# EAGLE board SparkFun_FreeSoC2 (EAGLE 7.3.0)
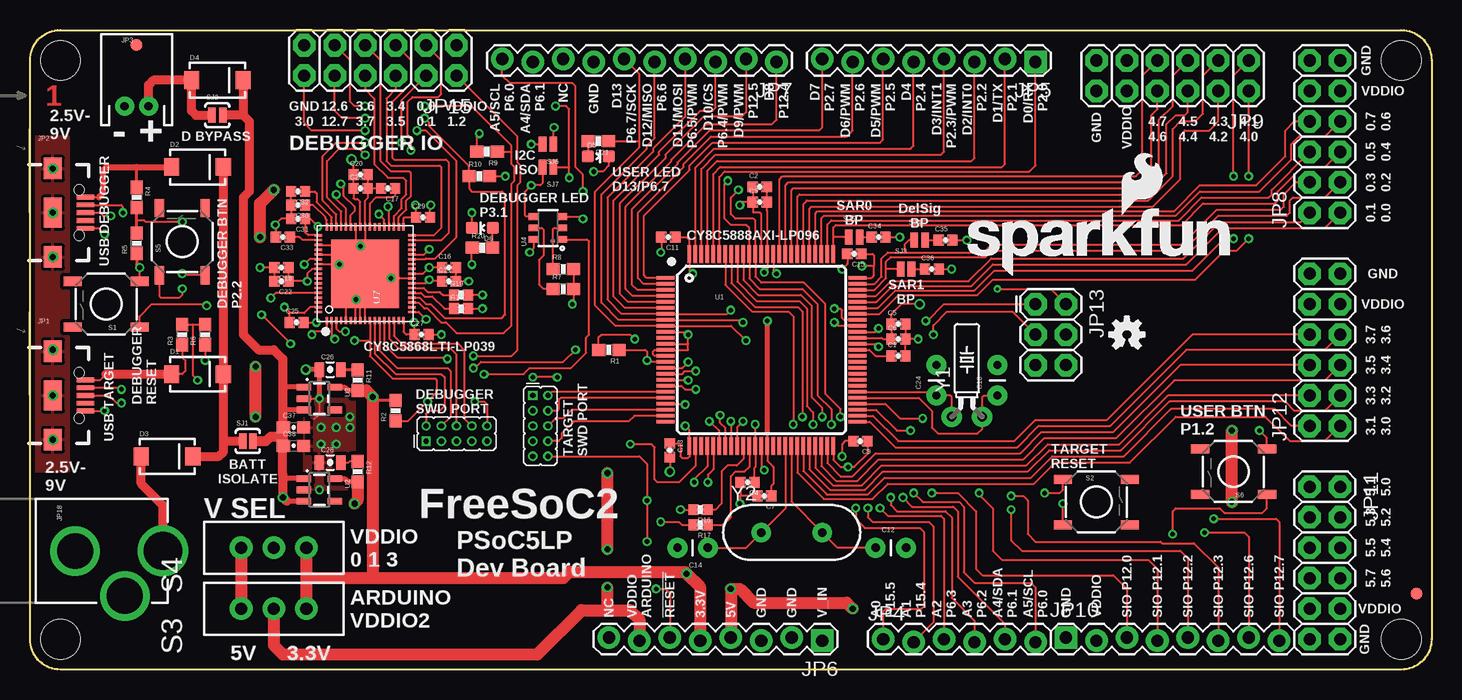
[diagram p3: board, top side]
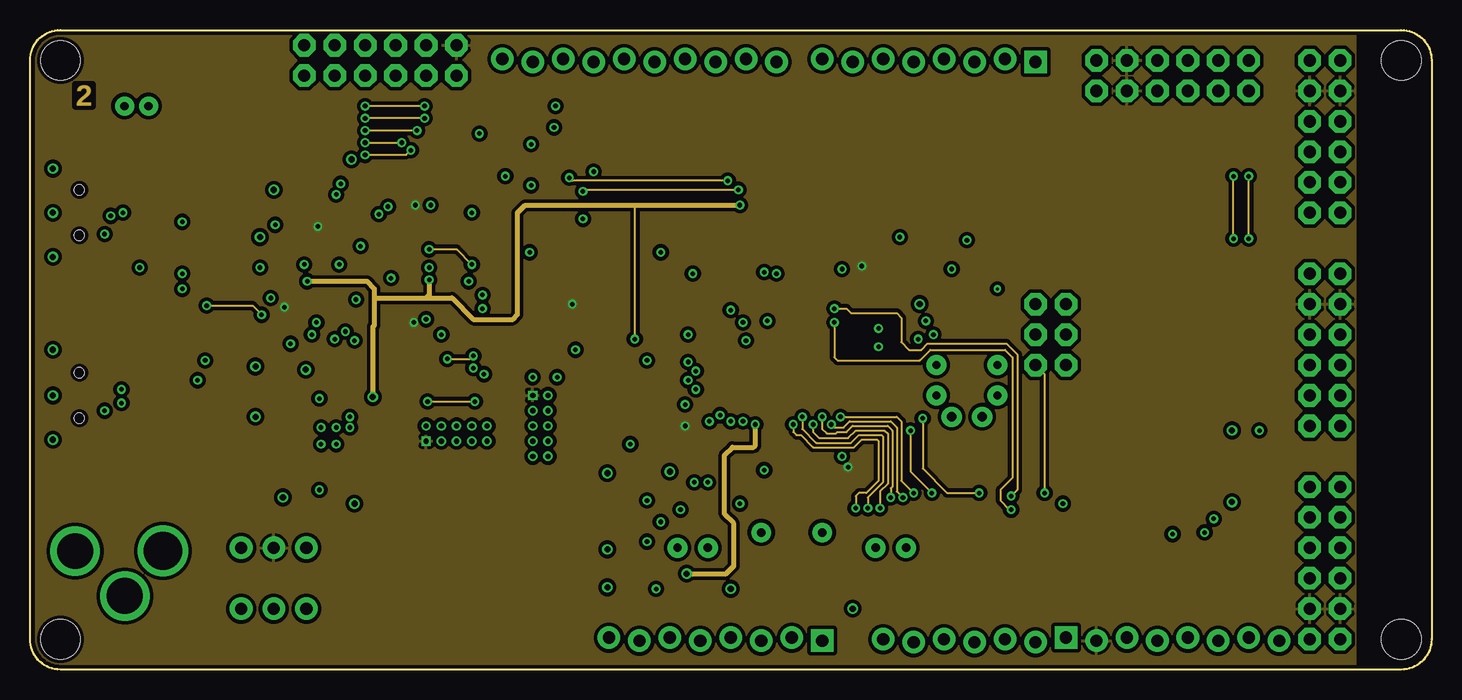
[diagram p4: board, inner layer Route2]
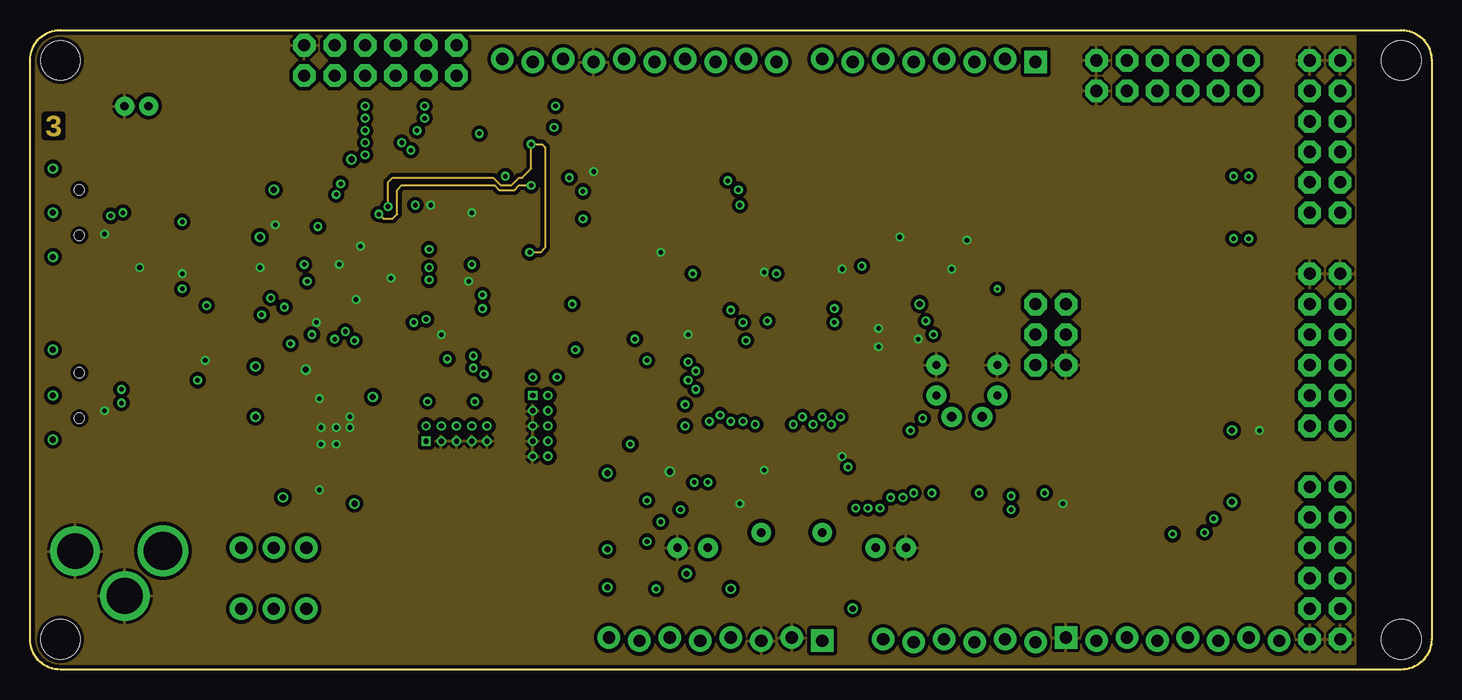
[diagram p5: board, inner layer Route15]
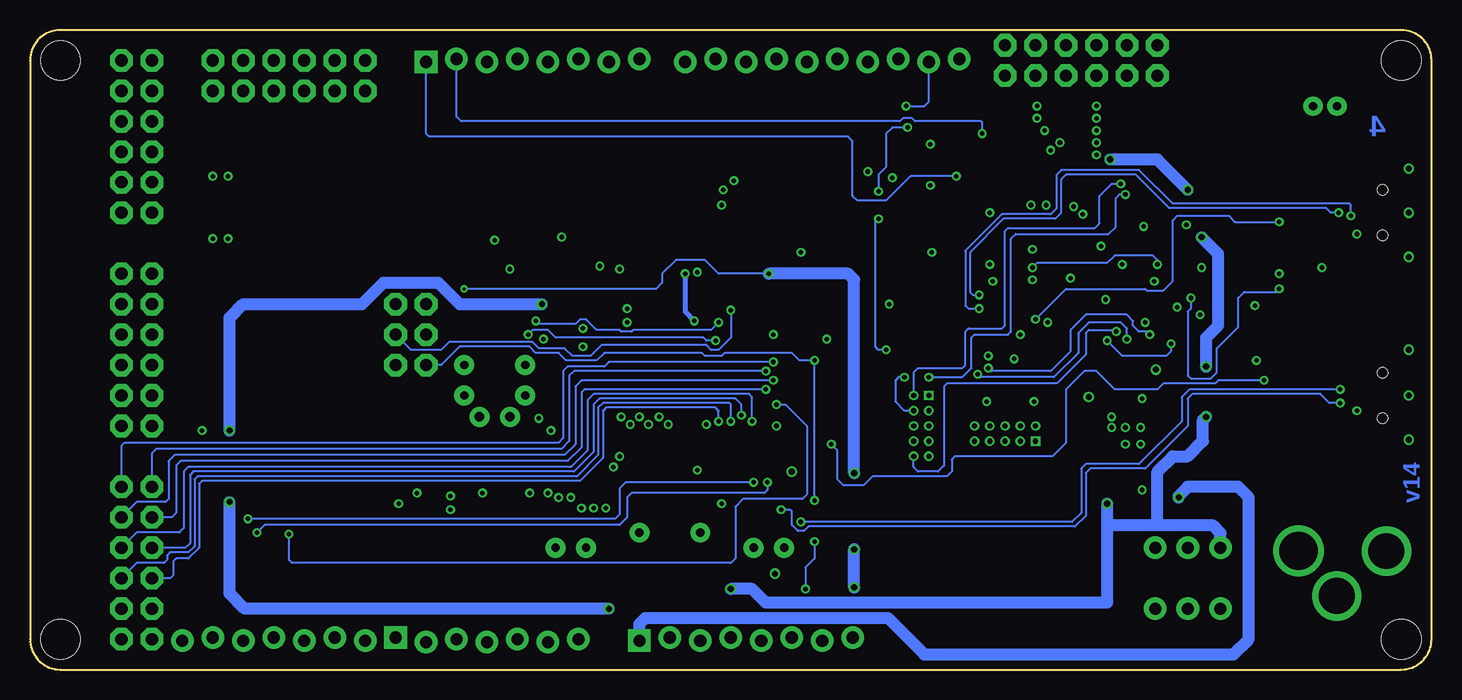
[diagram p6: board, bottom side, seen from below]

Size 116.84 x 53.34 mm. Coordinates in mm from the lower left corner, seen from the top.
Outline: 114.3,0 2.54,0 arc-90 0,2.54 0,50.8 arc-90 2.54,53.34 114.3,53.34 arc-90 116.84,50.8 116.84,2.54 arc-90 114.3,0
Copper layers (1*2*15*16): Top 0.035mm / dielectric 1.5mm / Route2 0.035mm / dielectric 0.15mm / Route15 0.035mm / dielectric 0.2mm / Bottom 0.035mm
Design rules "SparkFun-2-layer-TIGHT *": minimum track width 7mil, minimum drill 15mil, track to track 7mil, track to pad 7mil, pad to pad 7mil, via to via 7mil, smd to smd 7mil, copper to edge 7mil, drill to drill 7mil, minimum pad ring 7mil, minimum via ring 7mil, stop-mask expansion 4mil, vias tented up to drill 20mil, thermal gap 10mil
Net classes: 0 signal: width 0.178 mm, drill 0.381 mm, clearance 0.178 mm; 1 AVCC: width 0.508 mm, drill 0.508 mm, clearance 0.178 mm; 2 ARDUINO_VCC: width 0.508 mm, drill 0.381 mm

## Footprints (pad centres in the part's own frame; a part is rotated, then mirrored left to right if it is on the bottom)
0402-CAP = smd 0.85 x 0.9: 1 -0.58,0; 2 0.58,0
CAP-PTH-SMALL = drill 0.7 pad 1.651: 1 0,0; 2 2.54,0
0805-CAP = smd 0.8 x 1.2: 1 -0.9,0; 2 0.9,0
0603-CAP = smd 1.1 x 1: 1 -0.85,0; 2 0.85,0
SMA-DIODE = smd 1.27 x 1.47: A -2.15,0; C 2.15,0
LED-0603 = smd 1 x 1: A 0,-0.877; C 0,0.877
FIDUCIAL-1X2 = smd 1 x 1: 1 0,0
USB-B-MICRO-SMD_V03 = smd 1.45 x 0.4: D+1 2.725,0; D-1 2.725,0.65; GND1 2.725,-1.3; ID1 2.725,-0.65; VBUS1 2.725,1.3 | smd 1.5 x 1.8: SHIELD1 0,3.685; SHIELD2 0,-3.685 | smd 1.5 x 2.5: SHIELD3 0,0 | hole 0.85: 2.2,1.9; 2.2,-1.9
JST-2-PTH = drill 0.7 pad 1.6: 1 -1,0; 2 1,0
1X06-SIP_LOCK = drill 1.016 pad 1.88: 1 0,0; 2 2.54,-0.254; 3 5.08,0; 4 7.62,-0.254; 5 10.16,0; 6 12.7,-0.254
1X08_LOCK = drill 1.016 pad 1.88 square: 1 0,0.127 | drill 1.016 pad 1.88: 2 2.54,-0.127; 3 5.08,0.127; 4 7.62,-0.127; 5 10.16,0.127; 6 12.7,-0.127; 7 15.24,0.127; 8 17.78,-0.127
1X10_LOCK = drill 1.016 pad 1.88: 1 0,0.127; 2 2.54,-0.127; 3 5.08,0.127; 4 7.62,-0.127; 5 10.16,0.127; 6 12.7,-0.127; 7 15.24,0.127; 8 17.78,-0.127; 9 20.32,0.127; 10 22.86,-0.127
2X6 = drill 1.016 pad 1.88 octagon: 1 0,0; 2 0,2.54; 3 2.54,0; 4 2.54,2.54; 5 5.08,0; 6 5.08,2.54; 7 7.62,0; 8 7.62,2.54; 9 10.16,0; 10 10.16,2.54; 11 12.7,0; 12 12.7,2.54
2X3 = drill 1.016 pad 1.88 octagon: 1 0,0; 2 0,2.54; 3 2.54,0; 4 2.54,2.54; 5 5.08,0; 6 5.08,2.54
2X5_PTH_SILK_.05 = drill 0.432 square: 1 0,6.35 | drill 0.432: 2 1.27,6.35; 3 0,5.08; 4 1.27,5.08; 5 0,3.81; 6 1.27,3.81; 7 0,2.54; 8 1.27,2.54; 9 0,1.27; 10 1.27,1.27
POWER_JACK_PTH_LOCK = drill 2.997 pad 4.115: GND 0.025,6.557; GNDBREAK 3.762,10.7 | drill 3.2 pad 4.115: PWR 0,13.878
0603-RES = smd 1.1 x 1: 1 -0.85,0; 2 0.85,0
0603-RES@1 = smd 1.1 x 1: 1 -0.85,0; 2 0.85,0
0402-RES = smd 0.85 x 0.9: 1 -0.58,0; 2 0.58,0
TACTILE-SWITCH-SMD = smd 1.524 x 0.762: 1 -2.794,1.905; 2 2.794,1.905; 3 -2.794,-1.905; 4 2.794,-1.905
SWITCH-SPDT_LOCK.007S = drill 1.016 pad 1.88: 1 0,2.718; 2 0,0; 3 0,-2.718
PAD-JUMPER-2-NC_BY_PASTE_YES_SILK = smd 0.635 x 1.27: 1 -0.401,0; 2 0.413,0
PAD-JUMPER-2-NO_YES_SILK = smd 0.635 x 1.27: 1 -0.45,0; 2 0.45,0
PAD-JUMPER-2-NO_NO_SILK = smd 0.635 x 1.27: 1 -0.45,0; 2 0.45,0
STAND-OFF = hole 3.302: 0,0
TQFP-100-14X14MM = smd 1.5 x 0.27: 1 -8,6; 2 -8,5.5; 3 -8,5; 4 -8,4.5; 5 -8,4; 6 -8,3.5; 7 -8,3; 8 -8,2.5; 9 -8,2; 10 -8,1.5; 11 -8,1; 12 -8,0.5; 13 -8,0; 14 -8,-0.5; 15 -8,-1; 16 -8,-1.5; 17 -8,-2; 18 -8,-2.5; 19 -8,-3; 20 -8,-3.5; 21 -8,-4; 22 -8,-4.5; 23 -8,-5; 24 -8,-5.5; 25 -8,-6; 51 8,-6; 52 8,-5.5; 53 8,-5; 54 8,-4.5; 55 8,-4; 56 8,-3.5; 57 8,-3; 58 8,-2.5; 59 8,-2; 60 8,-1.5; 61 8,-1; 62 8,-0.5; 63 8,0; 64 8,0.5; 65 8,1; 66 8,1.5; 67 8,2; 68 8,2.5; 69 8,3; 70 8,3.5; 71 8,4; 72 8,4.5; 73 8,5; 74 8,5.5; 75 8,6 | smd 0.27 x 1.5: 26 -6,-8; 27 -5.5,-8; 28 -5,-8; 29 -4.5,-8; 30 -4,-8; 31 -3.5,-8; 32 -3,-8; 33 -2.5,-8; 34 -2,-8; 35 -1.5,-8; 36 -1,-8; 37 -0.5,-8; 38 0,-8; 39 0.5,-8; 40 1,-8; 41 1.5,-8; 42 2,-8; 43 2.5,-8; 44 3,-8; 45 3.5,-8; 46 4,-8; 47 4.5,-8; 48 5,-8; 49 5.5,-8; 50 6,-8; 76 6,8; 77 5.5,8; 78 5,8; 79 4.5,8; 80 4,8; 81 3.5,8; 82 3,8; 83 2.5,8; 84 2,8; 85 1.5,8; 86 1,8; 87 0.5,8; 88 0,8; 89 -0.5,8; 90 -1,8; 91 -1.5,8; 92 -2,8; 93 -2.5,8; 94 -3,8; 95 -3.5,8; 96 -4,8; 97 -4.5,8; 98 -5,8; 99 -5.5,8; 100 -6,8
SOT23-5 = smd 0.55 x 1.2: 1 -0.95,-1.3; 2 0,-1.3; 3 0.95,-1.3; 4 0.95,1.3; 5 -0.95,1.3
SOT26 = smd 0.55 x 0.8: D1 -0.95,1.2; D2 0.95,1.2; G1 -0.95,-1.2; G2 0.95,-1.2; S1 0,1.2; S2 0,-1.2
QFN-68 = smd 0.6 x 0.2: 1 -3.9,3.2; 2 -3.9,2.8; 3 -3.9,2.4; 4 -3.9,2; 5 -3.9,1.6; 6 -3.9,1.2; 7 -3.9,0.8; 8 -3.9,0.4; 9 -3.9,0; 10 -3.9,-0.4; 11 -3.9,-0.8; 12 -3.9,-1.2; 13 -3.9,-1.6; 14 -3.9,-2; 15 -3.9,-2.4; 16 -3.9,-2.8; 17 -3.9,-3.2; 35 3.9,-3.2; 36 3.9,-2.8; 37 3.9,-2.4; 38 3.9,-2; 39 3.9,-1.6; 40 3.9,-1.2; 41 3.9,-0.8; 42 3.9,-0.4; 43 3.9,0; 44 3.9,0.4; 45 3.9,0.8; 46 3.9,1.2; 47 3.9,1.6; 48 3.9,2; 49 3.9,2.4; 50 3.9,2.8; 51 3.9,3.2 | smd 0.2 x 0.6: 18 -3.2,-3.9; 19 -2.8,-3.9; 20 -2.4,-3.9; 21 -2,-3.9; 22 -1.6,-3.9; 23 -1.2,-3.9; 24 -0.8,-3.9; 25 -0.4,-3.9; 26 0,-3.9; 27 0.4,-3.9; 28 0.8,-3.9; 29 1.2,-3.9; 30 1.6,-3.9; 31 2,-3.9; 32 2.4,-3.9; 33 2.8,-3.9; 34 3.2,-3.9; 52 3.2,3.9; 53 2.8,3.9; 54 2.4,3.9; 55 2,3.9; 56 1.6,3.9; 57 1.2,3.9; 58 0.8,3.9; 59 0.4,3.9; 60 0,3.9; 61 -0.4,3.9; 62 -0.8,3.9; 63 -1.2,3.9; 64 -1.6,3.9; 65 -2,3.9; 66 -2.4,3.9; 67 -2.8,3.9; 68 -3.2,3.9 | smd 5.7 x 5.7: 69 0,0
TC26H = drill 0.813 pad 1.676: 1 -1.27,0; 2 1.27,0
HC49US = drill 0.7 pad 1.651: 1 -2.54,0; 2 2.54,0

## Placement (x,y rotation side)
C1  1.0uF  [0402-CAP]  72.39,26.16 0 top
C2  1.0uF  [0402-CAP]  60.83,40.26 0 top
C3  0.1uF  [0402-CAP]  60.83,38.99 0 top
C4  1.0uF  [0402-CAP]  59.82,15.62 180 top
C5  1.0uF  [0402-CAP]  72.39,28.83 0 top
C6  0.1uF  [0402-CAP]  72.39,27.56 0 top
C7  1.0uF  [0402-CAP]  61.21,14.48 180 top
C9  0.1uF  [0402-CAP]  69.22,19.05 180 top
C11  0.1uF  [0402-CAP]  53.21,36.07 180 top
C12  [CAP-PTH-SMALL]  70.48,10.16 0 top
C13  0.1uF  [0402-CAP]  53.34,18.29 270 top
C14  [CAP-PTH-SMALL]  56.52,10.16 180 top
C15  0.1uF  [0402-CAP]  68.71,34.67 180 top
C16  1.0uF  [0402-CAP]  34.92,33.53 0 top
C17  1.0uF  [0402-CAP]  29.84,40.13 180 top
C18  [CAP-PTH-SMALL]  80.64,22.86 90 top
C19  1.0uF  [0402-CAP]  20.95,33.53 180 top
C20  1.0uF  [0402-CAP]  27.56,41.27 0 top
C21  0.1uF  [0402-CAP]  34.92,32.38 0 top
C22  0.1uF  [0402-CAP]  20.95,32.38 180 top
C23  0.1uF  [0402-CAP]  27.56,40.13 0 top
C24  [CAP-PTH-SMALL]  75.56,22.86 90 top
C25  0.1uF  [0402-CAP]  22.23,28.96 0 top
C26  10uF  [0805-CAP]  25.02,25.02 0 top
C27  0.1uF  [0402-CAP]  32.64,27.94 0 top
C28  10uF  [0805-CAP]  25.02,17.27 0 top
C29  0.1uF  [0402-CAP]  32.77,37.72 0 top
C30  0.1uF  [0402-CAP]  22.35,38.73 180 top
C31  0.1uF  [0402-CAP]  22.35,37.59 180 top
C32  0.1uF  [0402-CAP]  22.35,39.88 180 top
C33  0.1uF  [0402-CAP]  21.08,36.07 180 top
C34  0.1uF  [0402-CAP]  70.74,36.07 0 top
C35  0.1uF  [0402-CAP]  76.33,35.81 0 top
C36  0.1uF  [0402-CAP]  75.18,33.4 0 top
C37  1.0uF  [0603-CAP]  21.97,20.19 0 top
C38  0.1uF  [0603-CAP]  21.97,18.67 0 top
D1  MBRA140  [SMA-DIODE]  13.97,24.64 0 top
D2  MBRA140  [SMA-DIODE]  13.97,41.91 0 top
D3  MBRA140  [SMA-DIODE]  11.43,17.78 0 top
D4  MBRA140  [SMA-DIODE]  15.62,49.15 0 top
D5  RED  [LED-0603]  47.37,42.8 270 top
D6  RED  [LED-0603]  37.72,36.83 90 top
FID1  FIDUCIAL1X2  [FIDUCIAL-1X2]  115.57,6.35 0 top
FID2  FIDUCIAL1X2  [FIDUCIAL-1X2]  8.89,52.07 0 top
FRAME1  FRAME-LETTERNO_PACKAGE  [DUMMY]  -15.24,-15.24 0 top  (outside the outline)
FRAME2  FRAME-LETTERNO_PACKAGE  [DUMMY]  -15.24,-16.51 0 top  (outside the outline)
FRAME3  FRAME-LETTERNO_PACKAGE  [DUMMY]  -15.24,-17.78 0 top  (outside the outline)
JP1  MicroB  [USB-B-MICRO-SMD_V03]  1.91,22.86 0 top
JP2  MicroB  [USB-B-MICRO-SMD_V03]  1.91,38.1 0 top
JP3  [JST-2-PTH]  8.89,46.99 0 top
JP4  1X6 FEMALE PTH  [1X06-SIP_LOCK]  71.12,2.54 0 top
JP5  1X8 FEMALE PTH  [1X08_LOCK]  83.82,50.8 180 top
JP6  1X8 FEMALE PTH  [1X08_LOCK]  66.04,2.54 180 top
JP7  1X10 FEMALE PTH  [1X10_LOCK]  62.23,50.8 180 top
JP8  2X6 FEMALE  [2X6]  109.22,38.1 90 top
JP9  2X6 FEMALE  [2X6]  101.6,50.8 180 top
JP10  1x8 FEMALE PTH  [1X08_LOCK]  86.36,2.54 0 top
JP11  2X6 FEMALE  [2X6]  106.68,15.24 270 top
JP12  2X6 FEMALE  [2X6]  109.22,20.32 90 top
JP13  [2X3]  83.82,30.48 270 top
JP14  DNP  [2X5_PTH_SILK_.05]  39.37,19.05 90 top
JP15  2X6 FEMALE  [2X6]  35.56,52.07 180 top
JP17  DNP  [2X5_PTH_SILK_.05]  41.91,16.51 0 top
JP18  POWER_JACKPTH_LOCK  [POWER_JACK_PTH_LOCK]  -2.79,9.91 270 top
LOGO1  SFE_LOGO_NAME_FLAME.2_INCH  [SFE_LOGO_NAME_FLAME_.2]  77.47,32.77 0 top
LOGO2  OSHW-LOGOS  [OSHW-LOGO-S]  91.44,27.94 0 top
R1  4.7K  [0603-RES]  48.26,26.67 180 top
R2  4.7K  [0603-RES]  30.48,21.59 90 top
R3  10K  [0603-RES]  12.7,27.94 90 top
R4  10K  [0603-RES]  8.89,39.37 270 top
R5  20k  [0603-RES]  8.89,35.56 90 top
R6  20k  [0603-RES]  14.61,27.94 90 top
R7  2.2k  [0603-RES]  44.45,31.75 0 top
R8  2.2k  [0603-RES]  44.45,33.4 0 top
R9  1K  [0603-RES@1]  38.1,43.18 180 top
R10  1K  [0603-RES@1]  37.47,41.15 0 top
R11  0.27  [0603-RES]  27.3,24.13 270 top
R12  0.27  [0603-RES]  27.3,16.51 270 top
R16  22  [0402-RES]  55.88,13.34 180 top
R17  22  [0402-RES]  55.88,12.06 180 top
R18  22  [0402-RES]  35.94,30.1 0 top
R19  22  [0402-RES]  35.94,31.24 0 top
R20  1K  [0603-RES@1]  37.72,35.18 0 top
R21  1K  [0603-RES@1]  47.37,44.07 180 top
S1  SPST-MOM  [TACTILE-SWITCH-SMD]  6.35,30.48 180 top
S2  SPST-MOM  [TACTILE-SWITCH-SMD]  88.9,13.97 0 top
S3  SPDT  [SWITCH-SPDT_LOCK.007S]  20.32,5.08 90 top
S4  SPDT  [SWITCH-SPDT_LOCK.007S]  20.32,10.16 90 top
S5  SPST-MOM  [TACTILE-SWITCH-SMD]  12.7,35.69 90 top
S6  SPST-MOM  [TACTILE-SWITCH-SMD]  100.33,16.51 180 top
SJ1  JUMPER-PAD-2-NC_BY_PASTE  [PAD-JUMPER-2-NC_BY_PASTE_YES_SILK]  18.16,19.05 0 top
SJ2  JUMPER-PAD-2-NOYES_SILK  [PAD-JUMPER-2-NO_YES_SILK]  15.62,46.23 0 top
SJ3  JUMPER-PAD-2-NO  [PAD-JUMPER-2-NO_NO_SILK]  73.03,33.4 0 top
SJ4  JUMPER-PAD-2-NO  [PAD-JUMPER-2-NO_NO_SILK]  74.17,35.81 0 top
SJ5  JUMPER-PAD-2-NO  [PAD-JUMPER-2-NO_NO_SILK]  68.71,36.07 0 top
SJ6  JUMPER-PAD-2-NO  [PAD-JUMPER-2-NO_NO_SILK]  43.18,43.81 180 top
SJ7  JUMPER-PAD-2-NO  [PAD-JUMPER-2-NO_NO_SILK]  43.18,41.91 180 top
STANDOFF1  STAND-OFF  [STAND-OFF]  2.54,2.54 0 top
STANDOFF2  STAND-OFF  [STAND-OFF]  2.54,50.8 0 top
STANDOFF3  STAND-OFF  [STAND-OFF]  114.3,50.8 0 top
STANDOFF4  STAND-OFF  [STAND-OFF]  114.3,2.54 0 top
U1  CY8C5888AXI-LP096  [TQFP-100-14X14MM]  60.96,26.67 0 top
U2  MIC5219 5V  [SOT23-5]  24.13,14.99 270 top
U3  MIC5219 3.3V  [SOT23-5]  24.13,22.61 270 top
U4  2A/20V  [SOT26]  43.18,36.83 90 top
U7  CY8C5868LTI-LP039  [QFN-68]  27.94,33.02 90 top
U$1  FOUR_LAYER_WARNING  [FOUR_LAYER_WARNING]  15.24,-2.16 0 top
U$2  [CREATIVE_COMMONS@1]  35.56,-27.94 0 top  (outside the outline)
Y1  32.768kHz  [TC26H]  78.11,21.08 0 top
Y2  [HC49US]  63.5,11.43 0 top

## Tracks (layer width: path | path; a pad name or v marks a point on that pad's centre or on a via)
3.3V  (via drill 0.38, 0.51)
  Top 0.178: 29,20.92 28.57,21.34 | C19.1 C22.1 v23.11,32.38 23.11,33.02 23.51,33.42 U7.59 | U7.24 32.98,32.22 v33.27,32.51 33.4,32.38 C21.1 | C4.1 60.4,16.84 60.47,16.91 U1.37 v60.46,20.44 v60.45,20.45 | U1.88 60.96,37.97 60.83,38.1 60.33,38.1 60.25,38.17 C3.1 | C2.1 C3.1 | C3.1 59.44,38.99 v59.18,38.73 | R1.2 47.41,27.73 47.62,27.94 50.04,27.94 v50.42,27.56
  Top 0.254: R2.2 28.87,22.44 v28.57,22.73
  Top 0.406: U3.5 26.23,23.56 26.5,23.28 R11.2
  Top 1.016: JP6.5 55.88,6.86 v54.74,8 54.61,8.13 44.96,8.13 44.45,7.62 28.45,7.62 | 28.45,7.62 23.04,7.62 | 28.45,7.62 28.57,7.75 28.57,21.34 v28.57,22.73 28.03,23.28 R11.2 | S4.3 23.04,7.62 | 23.04,7.62 S3.3
  Route2 0.178: v50.42,27.56 50.42,38.73
  Route2 0.406: v23.11,32.38 28.07,32.38 28.7,31.75 28.7,30.99 | 28.7,30.99 28.7,28.7 28.57,28.57 v28.57,22.73 | v54.74,8 58.04,8 58.67,8.64 58.67,12.19 57.91,12.95 57.91,17.91 58.55,18.54 60.33,18.54 U1.37 v60.46,20.44 v60.45,20.45 | 57.78,38.73 v59.18,38.73 50.42,38.73 41.27,38.73 40.64,38.1 40.64,29.59 40.26,29.21 36.96,29.21 35.18,30.99 33.02,30.99 | 28.7,30.99 33.02,30.99 | v33.27,32.51 33.27,31.24 33.02,30.99
5V  (via drill 0.51)
  Top 0.178: 25.36,16 U2.5 | U1.65 71.01,27.67 71.12,27.56 C6.1 C5.1 71.81,29.16 71.75,29.21 | 71.75,29.21 71.75,29.59 72.64,30.48 v74.17,30.48 | 71.75,29.21 71.75,28.84 | U7.44 27.54,39.01 27.3,39.24 27.05,39.24 26.98,39.31 C23.1 C20.1 26.98,42.36 v26.8,42.55 26.91,42.43
  Top 0.406: U2.5 26.23,15.94 26.5,15.66 R12.2
  Top 1.016: S4.1 S3.1 | JP6.4 v58.42,6.73 59.18,6.73 60.33,5.59 68.07,5.59 v68.58,5.08 | v100.2,13.97 v100.2,19.94 | v18.8,21.08 v18.8,25.27 | v19.18,36.07 19.18,38.86 v20.32,40.01 | R12.2 27.3,14.1 v27.05,13.84
  Bottom 1.016: 27.05,12.06 22.86,12.06 | 22.86,12.06 18.29,12.06 17.6,11.38 S4.1 | v27.05,13.84 27.05,12.06 | 27.05,12.06 27.05,5.59 55.5,5.59 56.64,6.73 v58.42,6.73 | v68.58,5.08 98.93,5.08 100.2,6.35 v100.2,13.97 | v100.2,19.94 100.2,29.34 99.06,30.48 89.15,30.48 87.38,32.26 82.8,32.26 81.03,30.48 v74.17,30.48 | 22.86,12.06 22.86,16.51 21.59,17.78 20.32,17.78 19.05,19.05 19.05,20.83 v18.8,21.08 | v18.8,25.27 18.8,27.69 17.78,28.7 17.78,34.67 v19.18,36.07 | v20.32,40.01 22.86,42.55 v26.8,42.55
!DEBUG_P2.6_SCL_PU_EN  (via drill 0.38)
  Top 0.178: U7.1 24.74,28.55 24.38,28.19 23.75,28.19 v23.5,27.94 | v36.96,25.15 37.08,25.15 37.59,25.65 44.45,25.65 v45.47,26.67 | U4.G2 45.91,37.78 v46.1,37.59
  Bottom 0.178: v23.5,27.94 23.75,28.19 24.38,28.19 24.89,28.7 24.89,29.08 25.4,29.59 28.83,29.59 30.1,28.32 30.1,26.54 31.75,24.89 36.7,24.89 v36.96,25.15 | v45.47,26.67 46.1,26.67 46.35,26.92 46.35,37.34 v46.1,37.59
!DEBUG_P2.7_SDA_PU_EN  (via drill 0.38)
  Top 0.178: U7.2 25.14,27.82 v25.4,27.56 | v37.85,24.64 41.15,24.64 41.66,25.15 45.09,25.15 46.35,26.42 46.35,27.69 46.61,27.94 46.61,35.69 46.42,35.88 U4.G1
  Bottom 0.178: v25.4,27.56 25.4,28.45 25.91,28.96 28.57,28.96 29.46,28.07 29.46,26.42 31.5,24.38 37.59,24.38 v37.85,24.64
!DEBUG_RESET  (via drill 0.38)
  Top 0.178: U7.10 28.34,27.43 | 28.34,27.43 28.34,26.14 30.23,24.26 33.78,24.26 33.91,24.13 33.91,23.11 v33.15,22.35 31.54,20.74 R2.1 | v37.08,22.35 37.85,22.35 38.1,22.1 JP14.10 | S1.1 9.14,29.46 10.16,30.48 14.61,30.48 v14.73,30.35 | v19.3,29.59 v21.72,27.18 | v27.05,27.43 28.34,27.43
  Route2 0.178: v33.15,22.35 v37.08,22.35 | v14.73,30.35 18.54,30.35 v19.3,29.59
  Bottom 0.178: v21.72,27.18 21.72,26.54 22.1,26.16 25.78,26.16 v27.05,27.43
!RESET  (via drill 0.38)
  Top 0.178: U1.15 51.55,25.67 v51.44,25.78 51.44,26.54 51.31,26.67 R1.1 | v84.58,14.73 85.85,14.73 86.11,14.99 S2.1 | v51.44,10.67 v51.44,14.1 51.44,17.14 50.8,17.78 JP17.10 | v52.2,6.73 52.96,6.73 53.34,6.35 JP6.6 | U7.3 25.54,28.43 25.78,28.19 v26.29,28.19
  Route2 0.178: JP13.5 84.58,24.64 v84.58,14.73
  Bottom 0.178: v51.44,14.1 v51.44,25.78 52.7,25.78 53.34,26.42 58.93,26.42 59.18,26.16 60.58,26.16 60.83,26.42 68.96,26.42 69.6,25.78 72.14,25.78 72.77,26.42 74.68,26.42 75.18,26.92 81.03,26.92 82.55,25.4 JP13.5 | JP17.10 43.18,16.89 42.8,16.51 41.15,16.51 40.64,17.02 40.64,23.62 40.39,23.88 31.24,23.88 28.83,26.29 28.83,28.07 28.57,28.32 26.42,28.32 v26.29,28.19 | v51.44,10.67 51.44,9.27 52.2,8.51 v52.2,6.73
A0  (via drill 0.38)
  Top 0.178: U1.94 57.96,32.08 60.2,29.84 63.25,29.84 63.63,29.46 v63.63,20.45 | v68.83,13.46 68.83,12.57 69.6,11.81 74.17,11.81 74.55,11.43 74.55,5.33 74.3,5.08 71.37,5.08 71.12,4.83 JP4.1
  Route2 0.178: v63.63,20.45 63.63,19.81 63.88,19.56 64.26,19.56 65.28,18.54 68.71,18.54 69.34,19.18 70.61,19.18 70.74,19.05 70.74,15.75 69.72,14.73 69.09,14.73 68.83,14.48 v68.83,13.46
A1  (via drill 0.38)
  Top 0.178: U1.93 58.46,32.22 60.45,30.23 64.01,30.23 64.39,29.84 v64.39,21.08 | v69.85,13.46 69.85,12.7 70.23,12.32 74.93,12.32 75.31,11.94 75.31,3.94 JP4.2
  Route2 0.178: v64.39,21.08 64.39,20.07 65.53,18.92 68.45,18.92 69.09,19.56 70.99,19.56 71.12,19.43 71.12,15.62 69.85,14.35 v69.85,13.46
A2  (via drill 0.38)
  Top 0.178: U1.92 58.96,32.35 60.58,30.73 64.14,30.73 64.77,30.1 64.77,21.97 65.28,21.46 v65.28,20.45 | v70.87,13.46 71.5,12.83 75.95,12.83 76.2,12.57 JP4.3
  Route2 0.178: v65.28,20.45 65.28,19.81 65.79,19.3 68.2,19.3 68.83,19.94 71.25,19.94 71.5,19.68 71.5,15.49 70.87,14.86 v70.87,13.46
A3  (via drill 0.38)
  Top 0.178: U1.91 59.46,32.49 60.71,31.24 64.26,31.24 65.15,30.35 65.15,22.73 66.04,21.84 v66.04,21.08 | v71.75,14.35 71.75,13.72 72.26,13.21 76.33,13.21 76.83,12.7 76.83,5.97 78.74,4.06 JP4.4
  Route2 0.178: v66.04,21.08 66.04,20.07 66.42,19.68 67.18,19.68 67.31,19.81 68.07,19.81 68.58,20.32 71.5,20.32 71.88,19.94 71.88,15.24 71.75,15.11 v71.75,14.35
A4  (via drill 0.38)
  Top 0.178: v66.8,20.45 66.8,21.72 65.66,22.86 65.66,30.48 64.39,31.75 60.83,31.75 59.96,32.62 U1.90 59.96,36.81 59.69,37.08 58.42,37.08 57.91,37.59 57.91,40.51 v58.17,40.77 | v72.77,14.35 73.53,13.59 76.96,13.59 77.34,13.21 77.34,7.75 81.28,3.81 JP4.5 | v44.96,41.02 44.96,41.91 | 44.96,41.91 44.96,46.74 44.7,46.99 v43.81,46.99 | SJ7.1 44.96,41.91
  Route2 0.178: v66.8,20.45 67.06,20.19 67.82,20.19 68.33,20.7 71.75,20.7 72.26,20.19 72.26,14.86 v72.77,14.35 | v58.17,40.77 45.21,40.77 v44.96,41.02
  Bottom 0.178: v43.81,46.99 42.29,46.99 41.91,47.37 JP7.9
A5  (via drill 0.38)
  Top 0.178: v59.05,40.01 58.42,39.37 58.42,37.97 58.8,37.59 60.33,37.59 60.46,37.46 U1.89 60.46,32.76 60.96,32.26 64.52,32.26 66.29,30.48 66.29,22.99 67.56,21.72 v67.56,21.08 | v46.1,39.88 46.1,41.27 45.47,41.91 45.47,48.64 45.21,48.9 40.01,48.9 39.37,49.53 JP7.10 | v73.66,14.73 74.42,13.97 77.47,13.97 77.85,13.59 77.85,8.13 78.74,7.24 83.44,7.24 83.82,6.86 JP4.6 | SJ6.1 43.63,45.15 v43.69,45.21
  Route2 0.178: v67.56,21.08 72.26,21.08 72.64,20.7 72.64,15.75 v73.66,14.73 | v59.05,40.01 46.23,40.01 v46.1,39.88
  Bottom 0.178: v43.69,45.21 44.96,45.21 45.47,44.7 45.47,41.91 46.1,41.27 v46.1,39.88
ANCHOR_POUR  (via drill 0.51)
  other vias: 1.91,38.1 1.91,22.86 1.91,19.18
  pour Top (isolate 0.305): 0,44.45 3.17,44.45 3.17,16.51 0,16.51
D0  (via drill 0.38)
  Top 0.178: U1.95 57.46,41.08 57.91,41.53 83.31,41.53 83.82,42.04 JP5.1 | R10.2 v39.62,41.15
  Bottom 0.178: JP5.1 83.82,44.7 83.57,44.45 48.64,44.45 48.26,44.07 48.26,39.5 47.88,39.12 45.47,39.12 43.43,41.15 v39.62,41.15
D1  (via drill 0.38)
  Top 0.178: U1.96 56.96,41.34 57.53,41.91 81.03,41.91 81.28,42.16 JP5.2 | R9.2 37.25,44.49 v37.47,44.7
  Bottom 0.178: v37.47,44.7 37.47,45.59 37.59,45.72 43.05,45.72 43.31,45.97 44.07,45.97 44.32,45.72 80.9,45.72 81.28,46.1 JP5.2
D2
  Top 0.178: U1.97 56.46,41.6 57.28,42.42 78.49,42.42 78.74,42.67 JP5.3
D3
  Top 0.178: U1.98 55.96,41.74 57.15,42.93 75.95,42.93 76.2,43.18 JP5.4
D4
  Top 0.178: U1.99 55.46,41.87 57.02,43.43 73.41,43.43 73.66,43.69 JP5.5
D5
  Top 0.178: U1.1 51.4,32.67 51.18,32.89 51.18,37.85 54.99,41.66 54.99,42.04 56.9,43.94 70.87,43.94 71.12,44.2 JP5.6
D6
  Top 0.178: U1.2 51.14,32.17 50.67,32.64 50.67,38.1 54.48,41.91 54.48,42.16 56.77,44.45 68.07,44.45 68.58,44.96 JP5.7
D7
  Top 0.178: JP5.8 66.04,45.21 65.79,44.96 56.64,44.96 53.98,42.29 53.98,42.16 50.16,38.35 50.16,32.13 50.63,31.67 U1.3
D8
  Top 0.178: U1.4 50.24,31.17 49.66,31.75 49.66,38.61 53.47,42.42 53.47,42.55 56.39,45.47 61.85,45.47 62.23,45.85 JP7.1
D9
  Top 0.178: JP7.2 59.69,46.48 59.31,46.1 56.13,46.1 52.96,42.93 52.96,42.67 49.15,38.86 49.15,31.37 49.85,30.67 U1.5
D10
  Top 0.178: U1.6 49.59,30.17 48.64,31.11 48.64,39.12 52.45,42.93 52.45,43.18 55.88,46.61 56.9,46.61 57.15,46.86 JP7.3
D11  (via drill 0.38)
  Top 0.178: JP7.4 54.61,46.1 51.94,43.43 51.94,43.18 48.13,39.37 48.13,30.86 49.32,29.67 U1.7 58.12,29.67 v58.42,29.97
  Bottom 0.178: v58.42,29.97 58.42,27.69 59.44,26.67 60.07,26.67 60.45,27.05 69.22,27.05 70.1,26.16 71.63,26.16 72.26,26.8 74.42,26.8 74.93,27.3 81.92,27.3 82.55,26.67 85.09,26.67 JP13.4
D12  (via drill 0.38)
  Top 0.178: JP7.5 52.07,44.32 51.44,43.69 51.44,43.43 47.62,39.62 47.62,30.61 49.06,29.17 U1.8 59.22,29.17 v59.44,28.96 | v74.68,29.08 74.8,29.08 76.2,30.48 JP13.1
  Bottom 0.178: v59.44,28.96 60.07,28.32 66.55,28.32 66.67,28.19 67.56,28.19 67.69,28.32 69.6,28.32 70.48,29.21 70.99,29.21 71.37,28.83 74.42,28.83 v74.68,29.08
D13  (via drill 0.38)
  Top 0.178: 50.8,44.07 50.8,43.56 47.12,39.88 47.12,30.35 48.8,28.67 U1.9 58.45,28.67 v59.69,27.43 | 50.8,44.07 50.8,49.66 JP7.6 | R21.1 50.8,44.07 | v75.31,27.94 75.31,28.7 76.45,29.84 81.92,29.84 JP13.3
  Bottom 0.178: v59.69,27.43 60.45,27.43 60.71,27.69 73.03,27.69 73.66,28.32 74.93,28.32 v75.31,27.94
DEBUG_BTN  (via drill 0.38)
  Top 0.178: U7.64 20.5,31.42 v20.07,30.99 | v12.7,31.75 12.7,31.24 12.45,30.99 10.92,30.99 10.79,31.11 S5.1
  Bottom 0.178: v20.07,30.99 20.07,30.1 20.32,29.84 20.32,24.51 20.07,24.26 18.41,24.26 17.91,24.77 17.91,26.8 16.13,28.57 16.13,30.99 15.62,31.5 12.95,31.5 v12.7,31.75
DEBUG_D+_BUS  (via drill 0.38)
  Top 0.178: JP2.D+1 5.84,38.1 6.1,37.85 v6.73,37.85 | 37.47,30.1 v37.72,30.1 R18.2
  Bottom 0.178: v6.73,37.85 6.73,38.73 6.86,38.86 21.59,38.86 24.38,41.66 30.86,41.66 31.24,41.27 31.24,38.48 31.75,37.97 35.81,37.97 38.86,34.92 38.86,30.35 38.61,30.1 v37.72,30.1
DEBUG_D+_PAD
  Top 0.178: U7.22 32.59,31.42 32.89,31.11 33.53,31.11 34.54,30.1 R18.1
DEBUG_D-_BUS  (via drill 0.38)
  Top 0.178: JP2.D-1 7.61,38.75 7.75,38.61 v7.75,38.1 | v37.72,31.24 R19.2
  Bottom 0.178: v7.75,38.1 8.38,38.1 8.76,38.48 21.84,38.48 24.64,41.27 30.48,41.27 30.86,40.89 30.86,38.1 31.37,37.59 35.69,37.59 38.48,34.8 38.48,31.5 38.23,31.24 v37.72,31.24
DEBUG_D-_PAD
  Top 0.178: U7.23 32.82,31.82 33.15,31.5 34.16,31.5 34.42,31.24 R19.1
DEBUG_DS_BP
  Top 0.178: U7.51 24.74,37.49 24.64,37.59 24.64,37.72 23.62,38.73 C30.1
DEBUG_LED  (via drill 0.38)
  Top 0.178: U7.30 32.84,34.62 v33.27,35.05 | v36.83,33.78 36.83,35.14 R20.1
  Route2 0.178: v33.27,35.05 35.56,35.05 v36.83,33.78
DEBUG_P0.0  (via drill 0.38)
  Top 0.178: U7.48 25.94,38.2 24.77,39.37 24.77,42.42 25.78,43.43 27.43,43.43 v27.94,42.93 | v31.75,43.31 31.75,44.32 31.5,44.58 31.5,47.37 31.88,47.75 34.04,47.75 34.29,48.01 34.29,50.8 JP15.3
  Route2 0.178: v27.94,42.93 31.37,42.93 v31.75,43.31
DEBUG_P0.1  (via drill 0.38)
  Top 0.178: U7.49 25.54,37.96 24.38,39.12 24.38,42.8 25.53,43.94 v27.94,43.94 | v30.99,43.94 30.99,47.5 JP15.4
  Route2 0.178: v27.94,43.94 v30.99,43.94
DEBUG_P1.2  (via drill 0.38)
  Top 0.178: U7.13 29.54,27.1 30.61,26.04 34.67,26.04 v34.8,25.91 | v36.96,26.16 40.13,26.16 40.64,26.67 40.64,40.39 40.89,40.64 40.89,42.04 40.64,42.29 40.64,44.45 JP15.2
  Route2 0.178: v34.8,25.91 36.7,25.91 v36.96,26.16
DEBUG_P3.0  (via drill 0.38)
  Top 0.178: U7.29 32.95,34.22 33.02,34.29 33.78,34.29 35.56,36.07 35.56,42.42 33.02,44.96 v32.26,44.96 | v27.94,44.96 23.5,44.96 22.86,45.59 JP15.12
  Route2 0.178: v32.26,44.96 v27.94,44.96
DEBUG_P3.4
  Top 0.178: U7.33 34.3,35.82 34.92,36.45 34.92,42.29 34.67,42.55 30.35,42.55 30.23,42.67 30.23,47.37 31.75,48.9 31.75,50.8 JP15.5
DEBUG_P3.5
  Top 0.178: U7.34 33.68,36.22 34.29,36.83 34.29,41.91 34.16,42.04 30.1,42.04 29.72,42.42 29.72,47.62 30.48,48.39 JP15.6
DEBUG_P3.6
  Top 0.178: JP15.7 29.21,50.8 29.21,42.42 30.1,41.53 31.62,41.53 31.75,41.4 31.75,39.5 31.37,39.12 31.37,38.35 30.74,37.73 U7.36
DEBUG_P3.7
  Top 0.178: JP15.8 27.94,48.39 28.7,47.62 28.7,42.16 29.84,41.02 31.11,41.02 31.37,40.77 31.37,39.62 30.99,39.24 30.99,38.48 30.34,37.83 U7.37
DEBUG_P12.0_SCL  (via drill 0.38)
  Top 0.178: U7.39 29.54,37.52 v29.08,37.97 | U4.D2 41.34,37.78 41.27,37.85 41.27,39.88 v41.78,40.39 42.55,40.39 42.73,40.57 SJ7.2
  Route15 0.178: v41.78,40.39 40.77,40.39 40.39,40.01 39.12,40.01 38.73,40.39 30.99,40.39 30.61,40.01 30.61,37.97 30.23,37.59 29.46,37.59 v29.08,37.97
DEBUG_P12.1_SDA  (via drill 0.38)
  Top 0.178: U7.38 29.94,38.51 v29.84,38.61 | U4.D1 41.98,35.12 v41.66,34.8 | v41.78,43.81 SJ6.2
  Route15 0.178: v41.66,34.8 42.55,34.8 42.93,35.18 42.93,43.56 42.67,43.81 v41.78,43.81 41.78,41.78 41.02,41.02 40.77,41.02 40.13,40.39 39.24,40.39 38.61,41.02 30.23,41.02 29.84,40.64 v29.84,38.61
DEBUG_P12.6_RX  (via drill 0.38)
  Top 0.178: 40.13,43.18 40.13,42.16 40.39,41.91 40.39,40.77 40.13,40.51 40.13,28.7 39.5,28.07 35.56,28.07 34.67,28.96 34.29,28.96 33.15,30.1 32.89,30.1 32.38,30.61 31.85,30.61 U7.20 | 40.13,43.18 40.13,43.69 36.83,46.99 v32.89,46.99 | v27.94,46.99 27.05,46.99 26.67,47.37 26.67,50.8 JP15.9 | R9.1 40.13,43.18
  Route2 0.178: v32.89,46.99 v27.94,46.99
DEBUG_P12.7_TX  (via drill 0.38)
  Top 0.178: v27.94,45.97 26.04,45.97 25.4,46.61 JP15.10 | U7.21 32.48,31.02 33.02,30.48 33.4,30.48 34.54,29.34 39.37,29.34 39.62,29.59 39.62,39.62 39.37,39.88 36.83,39.88 36.62,40.09 R10.1 36.62,42 33.27,45.34 33.27,45.59 v32.89,45.97
  Route2 0.178: v32.89,45.97 v27.94,45.97
DEBUG_SAR0_BP
  Top 0.178: U7.53 22.73,35.82 22.48,36.07 C33.1
DEBUG_SAR1_BP
  Top 0.178: C32.1 23.75,39.88 23.88,39.75 23.88,38.99 25.15,37.72 25.14,37.71 U7.50
DEBUG_SWDCK_TCK
  Top 0.178: U7.12 29.14,26.61 30.61,25.15 34.8,25.15 35.05,24.89 35.05,21.08 JP14.4
DEBUG_SWDIO_TMS
  Top 0.178: U7.11 28.74,26.38 30.48,24.64 34.29,24.64 34.54,24.38 34.54,21.97 34.16,21.59 33.27,21.59 33.02,21.34 JP14.2
DEBUG_SWV_TDO
  Top 0.178: JP14.6 35.56,26.29 35.05,26.8 30.73,26.8 29.94,27.59 U7.14
DEBUG_TDI
  Top 0.178: U7.15 30.34,27.83 30.99,27.18 35.69,27.18 36.2,26.67 36.2,20.95 JP14.8
GND  (via drill 0.38, 0.51)
  Top 0.152: 26.67,35.56 25.4,35.56 25.26,35.42 U7.54 27,35.42 27.14,35.56 | U7.56 26.81,34.62 27.14,34.29
  Top 0.178: C2.2 C3.2 61.41,38.27 61.46,38.22 U1.87 61.46,33.39 v61.21,33.15 | S2.3 v86.11,13.84 | U1.66 70.46,28.17 v70.74,28.45 | U1.10 54.63,28.17 v54.86,27.94 54.86,27.18 54.86,27.17 | U1.12 54.86,27.17 | 54.86,27.17 54.86,27.16 54.86,26.67 U1.13 52.07,26.67 51.94,26.54 51.94,26.29 52.06,26.17 U1.14 | JP1.GND1 6.19,21.56 v6.22,21.59 | JP2.GND1 5.75,36.8 v6.22,36.32 | S1.3 v9.14,33.53 | U7.25 28.34,32.62 U7.69 | U7.9 U7.69 | U7.58 27.14,33.82 | U7.45 27.14,35.56 27.14,34.29 27.14,33.82 | 27.14,33.82 U7.69 | U7.7 27.14,32.22 U7.69 | U7.5 26.34,32.69 26.67,33.02 U7.69 | U7.8 27.54,32.62 U7.69 | U3.2 v24.13,22.61 24.13,21.34 23.66,20.87 | v25.78,33.78 27.18,33.78 U7.69 | v67.69,33.4 68.13,33.84 C15.2 | U7.69 U7.43 27.93,36.94 27.93,39.1 28.14,39.31 C23.2 | U1.64 70.49,27.17 v70.74,26.92 | C5.2 C6.2 | C1.2 C6.2 | v74.04,27.56 C6.2 | U1.38 60.96,16.89 v61.21,16.64 | 52.56,34.81 v52.58,34.8 52.63,34.85 C11.2 | C9.2 67.94,19.05 67.69,18.8 v67.69,17.78 | 20.43,37.07 v20.45,37.08 | v20.45,37.08 20.95,37.59 C31.2 C30.2 C32.2 | D6.C 36.84,38.09 v36.83,38.1 | C36.2 v76.83,33.4 | C34.2 v72.52,36.07 | C35.2 v78.11,35.81 | 59.17,14.48 59.17,13.86 v59.18,13.84 | C7.2 59.17,14.48 | D5.C 48.25,42.02 47.75,41.53 v46.99,41.53 | S6.3 103.12,19.3 v102.49,19.94 | 33.42,38.72 v33.4,38.73 33.35,38.68 C29.2 | C16.2 C21.2 v36.58,32.38 | C27.2 v34.29,27.94 | C25.2 v23.88,28.96 | C22.2 C19.2 20.36,33.54 19.19,33.54 v19.18,33.53 | S5.3 12.83,32.89 v12.7,33.02 | C20.2 C23.2 | R6.1 v14.61,25.78 | C13.2 v53.34,16.51 | C33.2 20.5,37.03 v20.45,37.08 | C4.2 59.24,14.55 59.17,14.48 | C23.2 C17.2
  Top 0.254: R5.1 8.89,33.78 v9.14,33.53
  Top 0.406: v24.13,22.61 24.13,25.01 C26.1 v22.99,25.02
  other vias: 27.18,30.86 27.56,35.31 30.1,32.64 24.13,14.99 26.67,20.19 26.67,21.08 24.26,20.19 24.26,18.8 25.53,20.19 25.53,18.8
  pour Route15 (isolate 0.305): 0,53.34 110.49,53.34 110.49,0 0,0
  pour Top (isolate 0.305): 27.05,22.61 27.05,14.99 22.86,14.99 22.86,22.61
N$1
  Top 0.254: C26.2 27.27,25.02 R11.1
N$2
  Top 0.178: 25.36,13.97 U2.4
N$3
  Top 0.178: SJ5.2 C34.1
N$4
  Top 0.178: SJ4.2 C35.1
N$5
  Top 0.178: SJ3.2 C36.1
N$6
  Top 0.178: C28.2 26.54,17.27 26.63,17.36 R12.1
N$7
  Top 0.178: R8.1 43.6,36.74 43.69,36.83 U4.S2
N$8
  Top 0.178: U4.S1 42.67,36.83 42.8,36.7 42.8,34.54 42.42,34.16 42.42,32.13 42.8,31.75 R7.1
N$9  (via drill 0.51)
  other vias: 1.91,41.78
N$10  (via drill 0.51)
  other vias: 1.91,34.42
N$11  (via drill 0.51)
  other vias: 1.91,26.67
N$13
  Top 0.762: D3.A 9.27,15.49 10.48,14.29 10.91,13.86 11.08,13.68 JP18.PWR
N$14  (via drill 0.38)
  Top 0.178: U7.26 32.77,33.02 v33.27,33.53 C16.1 | U7.57 23.3,34.22 v22.86,33.78
  Bottom 0.178: v33.27,33.53 32.89,33.91 27.05,33.91 26.42,34.54 23.24,34.54 22.86,34.16 v22.86,33.78
N$16
  Top 0.406: 17.53,19.05 SJ1.1
  Top 0.762: D2.C D1.C 16.12,24.26 | 16.12,24.26 16.12,23.74 | D3.C 15.75,17.78 16.13,18.16 16.13,18.92 | 16.13,18.92 16.13,24.25 16.12,24.26 | 16.13,18.92 16.26,19.05 17.53,19.05
N$17
  Top 0.406: 14.99,46.23 SJ2.1
  Top 0.762: JP3.2 9.89,48.75 10.29,49.15 D4.A 13.46,46.61 13.84,46.23 14.99,46.23
N$23
  Top 0.178: R20.2 38.57,36.8 D6.A
N$26
  Top 0.178: R21.2 46.52,42.83 D5.A
N$27
  Top 0.178: U7.42 28.34,38.88 28.83,39.37 30.23,39.37 30.43,39.57 C17.1
P0.0
  Top 0.178: U1.71 70.55,30.67 71.88,32 78.49,32 80.26,33.78 96.39,33.78 99.44,36.83 107.95,36.83 JP8.1
P0.1
  Top 0.178: U1.72 70.54,31.17 71.75,32.38 78.23,32.38 80.14,34.29 96.14,34.29 99.19,37.34 105.92,37.34 JP8.2
P0.2
  Top 0.178: U1.73 70.41,31.67 71.37,32.64 71.37,33.4 | 71.37,33.4 71.37,34.04 71.75,34.42 79.63,34.42 80.14,34.92 96.14,34.92 99.06,37.85 104.78,37.85 105.03,38.1 105.03,39.12 105.28,39.37 107.95,39.37 JP8.3 | SJ3.1 71.37,33.4
P0.3
  Top 0.178: U1.74 70.4,32.17 70.99,32.77 70.99,34.29 71.5,34.8 72.9,34.8 | 72.9,34.8 79.5,34.8 80.14,35.43 96.01,35.43 98.93,38.35 104.27,38.35 104.52,38.61 104.52,39.62 105.54,40.64 JP8.4 | SJ4.1 73.28,35.81 72.9,35.43 72.9,34.8
P0.4
  Top 0.178: U1.76 66.96,36.07 | 66.96,36.07 66.96,36.86 67.18,37.08 96.01,37.08 97.79,38.86 103.76,38.86 104.01,39.12 104.01,39.88 106.05,41.91 107.95,41.91 JP8.5 | SJ5.1 66.96,36.07
P0.5
  Top 0.178: U1.77 66.46,37.12 66.8,37.47 95.76,37.47 97.66,39.37 103.25,39.37 103.5,39.62 103.5,40.01 JP8.6
P0.6
  Top 0.178: U1.78 65.96,37.64 66.17,37.85 95.5,37.85 97.54,39.88 102.49,39.88 105.16,42.55 105.16,43.81 105.79,44.45 107.95,44.45 JP8.7
P0.7
  Top 0.178: U1.79 65.46,38.03 65.66,38.23 95.38,38.23 97.54,40.39 102.23,40.39 104.65,42.8 104.65,44.96 105.41,45.72 JP8.8
P1.0  (via drill 0.38)
  Top 0.178: U1.20 43.49,23.17 JP17.2 | U7.46 26.74,37.92 27.05,38.23 27.05,38.61 26.16,39.5 26.16,40.26 v25.91,40.51
  Bottom 0.178: JP17.2 43.18,24.77 42.8,25.15 39.12,25.15 38.86,25.4 38.86,28.19 38.61,28.45 35.81,28.45 35.56,28.7 35.56,36.58 35.31,36.83 28.07,36.83 27.69,37.21 27.69,39.5 26.67,40.51 v25.91,40.51
P1.1  (via drill 0.38)
  Top 0.178: U1.21 44.26,22.67 44.07,22.48 44.07,21.72 43.94,21.59 JP17.4 | U7.47 26.34,38.43 25.53,39.24 v25.53,39.62 | v43.94,24.38 v41.91,24.38
  Bottom 0.178: v43.94,24.38 44.45,24.38 44.7,24.13 44.7,22.35 43.94,21.59 JP17.4 | v41.91,24.38 39.12,24.38 38.35,25.15 38.35,27.69 38.1,27.94 35.31,27.94 35.05,28.19 35.05,35.94 34.67,36.32 26.94,36.32 U7.47 26.34,39.32 26.04,39.62 v25.53,39.62
P1.2  (via drill 0.38)
  Top 0.178: U1.22 54.54,22.17 v54.61,22.1 | v95.25,11.3 95.25,13.21 95.5,13.46 99.19,13.46 99.57,13.08 102.74,13.08 103.12,13.46 S6.1
  Bottom 0.178: v54.61,22.1 53.85,22.1 52.07,20.32 52.07,14.61 52.45,14.22 57.4,14.22 58.04,13.59 58.04,9.27 58.42,8.89 95,8.89 95.25,9.14 v95.25,11.3
P1.3
  Top 0.178: U1.23 45.16,21.67 44.45,20.95 43.81,20.95 JP17.6
P1.4
  Top 0.178: U1.24 50.38,21.17 49.91,20.7 45.34,20.7 44.32,19.68 44.32,19.3 44.07,19.05 JP17.8
P3.0
  Top 0.178: U1.44 63.96,16.43 66.17,14.22 70.23,14.22 71.5,15.49 83.69,15.49 85.47,17.27 91.69,17.27 95.5,21.08 103,21.08 105.03,19.05 107.95,19.05 JP12.1
P3.1
  Top 0.178: U1.45 64.46,16.57 66.42,14.61 69.85,14.61 71.25,16 83.44,16 85.22,17.78 91.19,17.78 95.12,21.72 103.76,21.72 105.16,20.32 JP12.2
P3.2
  Top 0.178: U1.46 64.96,16.7 66.67,14.99 69.6,14.99 71.12,16.51 83.19,16.51 84.96,18.29 90.93,18.29 95,22.35 104.65,22.35 105.41,21.59 107.95,21.59 JP12.3
P3.3
  Top 0.178: U1.47 65.46,16.84 66.93,15.37 69.34,15.37 70.99,17.02 83.06,17.02 84.84,18.8 90.81,18.8 94.87,22.86 JP12.4
P3.4
  Top 0.178: U1.48 65.96,16.97 67.18,15.75 68.96,15.75 70.74,17.53 82.8,17.53 84.58,19.3 90.55,19.3 95.38,24.13 107.95,24.13 JP12.5
P3.5
  Top 0.178: U1.49 66.46,17.23 67.56,16.13 68.58,16.13 70.48,18.03 82.55,18.03 84.33,19.81 90.3,19.81 95.89,25.4 JP12.6
P3.6
  Top 0.178: U1.51 70.01,20.67 72.14,18.54 82.3,18.54 84.07,20.32 90.04,20.32 96.39,26.67 107.95,26.67 JP12.7
P3.7
  Top 0.178: U1.52 70.27,21.17 72.39,19.05 82.04,19.05 83.82,20.83 89.79,20.83 96.9,27.94 JP12.8
P4.0  (via drill 0.38)
  Top 0.178: U1.69 70.82,29.67 72.39,31.24 78.99,31.24 80.26,32.51 97.16,32.51 99.57,34.92 100.58,34.92 v101.6,35.94 | v101.6,41.15 JP9.2
  Route2 0.178: v101.6,35.94 v101.6,41.15
P4.1  (via drill 0.38)
  Top 0.178: U1.70 70.68,30.17 72.14,31.62 78.74,31.62 80.39,33.27 96.9,33.27 99.57,35.94 v100.33,35.94 | v100.33,41.15 100.33,49.53 JP9.1
  Route2 0.178: v100.33,35.94 v100.33,41.15
P4.2
  Top 0.178: U1.80 64.96,38.42 65.15,38.61 93.6,38.61 95.89,40.89 95.89,44.58 96.27,44.96 98.3,44.96 99.06,45.72 JP9.4
P4.3
  Top 0.178: U1.81 64.46,38.81 64.77,39.12 93.22,39.12 95.25,41.15 95.25,45.09 95.89,45.72 97.16,45.72 97.79,46.35 97.79,49.53 JP9.3
P4.4
  Top 0.178: U1.82 63.96,39.45 64.14,39.62 92.96,39.62 94.74,41.4 94.74,45.47 95.5,46.23 96.27,46.23 96.52,46.48 JP9.6
P4.5
  Top 0.178: U1.83 63.46,39.97 63.63,40.13 92.71,40.13 94.11,41.53 94.11,45.85 95.25,46.99 95.25,49.53 JP9.5
P4.6
  Top 0.178: U1.84 62.96,40.35 63.25,40.64 92.46,40.64 93.47,41.66 93.47,46.23 93.98,46.74 JP9.8
P4.7
  Top 0.178: U1.85 62.46,40.87 62.74,41.15 92.2,41.15 92.71,41.66 92.71,49.53 JP9.7
P5.0  (via drill 0.38)
  Top 0.178: U1.16 54.38,25.17 v54.86,25.65
  Bottom 0.178: v54.86,25.65 68.58,25.65 68.96,25.27 72.01,25.27 72.39,24.89 72.39,19.3 72.77,18.92 108.97,18.92 109.22,18.67 JP11.2
P5.1  (via drill 0.38)
  Top 0.178: U1.17 54.39,24.67 54.61,24.89 v55.5,24.89
  Bottom 0.178: v55.5,24.89 71.5,24.89 71.88,24.51 71.88,19.05 72.52,18.41 106.3,18.41 106.68,18.03 JP11.1
P5.2  (via drill 0.38)
  Top 0.178: U1.18 54.82,24.17 v54.86,24.13
  Bottom 0.178: v54.86,24.13 70.87,24.13 71.37,23.62 71.37,18.8 72.26,17.91 104.78,17.91 105.28,17.4 105.28,14.22 105.54,13.97 107.95,13.97 JP11.4
P5.3  (via drill 0.38)
  Top 0.178: U1.19 54.31,23.67 54.61,23.37 v55.5,23.37
  Bottom 0.178: v55.5,23.37 70.61,23.37 70.87,23.11 70.87,18.54 72.01,17.4 104.27,17.4 104.65,17.02 104.65,13.08 105.03,12.7 JP11.3
P5.4  (via drill 0.38)
  Top 0.178: U1.31 57.46,19.88 v56.64,20.7
  Bottom 0.178: v56.64,20.7 56.64,22.73 56.9,22.99 69.85,22.99 70.36,22.48 70.36,18.29 71.75,16.89 103.63,16.89 104.01,16.51 104.01,11.81 104.39,11.43 107.95,11.43 JP11.6
P5.5  (via drill 0.38)
  Top 0.178: U1.32 57.96,20.14 57.53,20.57 v57.53,21.21
  Bottom 0.178: v57.53,21.21 57.53,22.1 58.04,22.61 69.34,22.61 69.85,22.1 69.85,18.16 71.5,16.51 103.25,16.51 103.5,16.26 103.5,10.54 103.89,10.16 JP11.5
P5.6  (via drill 0.38)
  Top 0.178: U1.33 58.46,20.66 v58.42,20.7
  Bottom 0.178: v58.42,20.7 58.42,22.1 58.55,22.23 69.09,22.23 69.47,21.84 69.47,17.91 71.25,16.13 102.87,16.13 103.12,15.88 103.12,10.29 103.63,9.78 105.16,9.78 105.41,9.53 105.41,9.14 105.66,8.89 107.95,8.89 JP11.8
P5.7  (via drill 0.38)
  Top 0.178: U1.34 58.96,20.23 v59.44,20.7
  Bottom 0.178: v59.44,20.7 59.44,21.59 59.69,21.84 68.83,21.84 69.09,21.59 69.09,17.65 70.99,15.75 102.49,15.75 102.74,15.49 102.74,10.16 103.63,9.27 104.65,9.27 104.9,9.02 104.9,7.87 105.16,7.62 JP11.7
P12.0  (via drill 0.38)
  Top 0.178: U1.53 70.53,21.67 72.26,19.94 v73.41,19.94 | v75.18,14.73 77.34,14.73 78.87,13.21 78.87,8.38 79.38,7.87 90.3,7.87 91.44,6.73 JP10.3
  Route2 0.178: v73.41,19.94 73.41,16.51 v75.18,14.73
P12.1  (via drill 0.38)
  Top 0.178: U1.54 71.3,22.17 72.52,20.95 v74.42,20.95 | v79.12,14.73 79.12,14.61 80.26,13.46 80.26,9.91 81.03,9.14 93.22,9.14 93.98,8.38 JP10.4
  Route2 0.178: v74.42,20.95 74.42,16.76 76.45,14.73 v79.12,14.73
P12.2  (via drill 0.38)
  Top 0.178: U1.67 67.41,28.67 67.12,28.96 v67.06,28.96 | v81.79,13.34 81.79,10.79 82.68,9.91 95.89,9.91 96.52,9.27 JP10.5
  Route2 0.178: v67.06,28.96 67.06,26.04 67.31,25.78 74.17,25.78 75.06,26.67 81.28,26.67 81.92,26.04 81.92,16 80.9,14.99 80.9,14.1 81.66,13.34 v81.79,13.34
P12.3  (via drill 0.38)
  Top 0.178: U1.68 67.86,29.17 67.69,29.34 67.69,29.97 67.6,30.06 67.1,30.06 v67.06,30.1 | v81.79,14.48 82.8,14.48 83.19,14.1 83.19,11.3 83.82,10.67 94.23,10.67 94.36,10.54 97.03,10.54 99.06,8.51 JP10.6
  Route2 0.178: v67.06,30.1 68.07,30.1 68.45,29.72 72.26,29.72 72.64,29.34 72.64,27.3 73.28,26.67 74.3,26.67 74.8,27.18 81.41,27.18 82.3,26.29 82.3,14.99 v81.79,14.48
P12.6  (via drill 0.38)
  Top 0.178: U1.29 56.46,16.96 55.37,15.88 v55.37,15.62 | v97.92,11.43 101.22,11.43 101.6,11.05 JP10.7
  Bottom 0.178: v55.37,15.62 55.37,14.99 55.63,14.73 66.67,14.73 67.06,14.35 67.06,12.7 67.69,12.06 97.28,12.06 v97.92,11.43
P12.7  (via drill 0.38)
  Top 0.178: U1.30 56.96,16.7 56.52,16.26 v56.52,15.62 | v98.68,12.57 103.89,12.57 104.14,12.32 JP10.8
  Bottom 0.178: v56.52,15.62 67.18,15.62 67.69,15.11 67.69,12.95 68.07,12.57 v98.68,12.57
P15.0
  Top 0.178: U1.42 62.96,13.43 Y2.1 59.69,10.16 C14.1
P15.1
  Top 0.178: U1.43 63.46,14.01 Y2.2 67.31,10.16 C12.1
P15.2
  Top 0.178: U1.55 74.1,22.67 75.18,21.59 75.18,20.19 75.69,19.68 78.99,19.68 79.38,20.07 Y1.2 79.38,22.73 79.5,22.86 C18.1
P15.3
  Top 0.178: U1.56 75.25,23.17 C24.1 76.71,22.86 76.83,22.73 Y1.1
PSOC_D+_BUS  (via drill 0.38)
  Top 0.178: JP1.D+1 6.6,22.86 7.24,22.23 v7.62,22.23 | v54.23,13.34 R16.2
  Bottom 0.178: v7.62,22.23 8.51,22.23 9.27,22.99 19.94,22.99 20.32,22.61 20.32,20.32 23.88,16.76 28.45,16.76 28.83,16.38 28.83,12.83 29.72,11.94 51.94,11.94 52.32,11.56 52.83,11.56 53.34,12.06 53.34,13.21 53.47,13.34 v54.23,13.34
PSOC_D+_PAD
  Top 0.178: U1.35 59.46,17.55 58.93,17.02 58.17,17.02 57.66,16.51 57.66,13.84 57.15,13.34 R16.1
PSOC_D-_BUS  (via drill 0.38)
  Top 0.178: JP1.D-1 7.48,23.51 v7.62,23.37 | v52.58,12.32 54.1,12.32 54.36,12.06 R17.2
  Bottom 0.178: v7.62,23.37 20.19,23.37 20.83,22.73 20.83,20.7 24.38,17.14 28.83,17.14 29.21,16.76 29.21,13.08 29.97,12.32 v52.58,12.32
PSOC_D-_PAD
  Top 0.178: R17.1 57.78,12.06 58.42,12.7 58.42,16.13 58.8,16.51 59.56,16.51 59.96,16.91 U1.36
V_BUS_DEBUG  (via drill 0.38)
  Top 0.178: U7.18 32.41,29.82 v33.02,29.21 | v12.7,37.34 9.65,37.34 9.53,37.47 8.89,37.47
  Top 0.254: R5.2 8.89,37.47 R4.2
  Bottom 0.178: v33.02,29.21 30.48,31.75 23.88,31.75 23.75,31.62 22.35,31.62 21.59,32.38 21.59,37.47 21.21,37.85 16.89,37.85 16.38,37.34 v12.7,37.34
V_BUS_HOST  (via drill 0.38)
  Top 0.178: R3.2 13.58,28.79 | 13.58,28.79 R6.2 | 13.58,28.79 13.58,24.52 v13.97,24.13 | U1.27 55.46,16.98 54.1,15.62 52.32,15.62 52.07,15.88 52.07,18.54 51.82,18.8 v50.04,18.8
  Bottom 0.178: v13.97,24.13 17.78,24.13 18.03,23.88 22.35,23.88 22.86,23.37 26.42,23.37 27.94,24.89 28.96,24.89 30.48,23.37 30.48,18.92 31.62,17.78 39.75,17.78 40.01,17.53 40.01,16.51 40.39,16.13 46.61,16.13 47.37,15.37 49.02,15.37 49.53,15.88 49.53,18.29 v50.04,18.8
V_DEBUG
  Top 0.178: JP2.VBUS1 5.75,39.4
  Top 0.254: R4.1 8.89,41.91
  Top 0.508: 5.75,39.4 6.1,39.75 6.1,41.66 6.35,41.91 8.89,41.91 D2.A
V_HOST
  Top 0.178: JP1.VBUS1 5.87,24.16 6.35,24.64 | R3.1 12.7,26.04 12.95,25.78 12.95,24.89 12.7,24.64 D1.A
  Top 0.254: 11.18,24.64 D1.A
  Top 0.762: 6.35,24.64 11.18,24.64
V_IN  (via drill 0.51)
  Top 0.406: U2.1 21.4,15.94 21.08,16.26 | U2.3 21.4,14.04 | U3.1 21.4,23.56 21.08,23.88 | U3.3 21.4,21.66 21.08,21.34 | SJ2.2 16.38,46.23 | SJ1.2 18.92,19.05 | 20.99,19.43 20.99,20.07 C37.1
  Top 0.762: 21.4,14.04 v21.08,14.36 21.08,16.26 21.08,18.63 C38.1 C37.1 21.08,20.23 21.08,21.34 21.08,23.88 21.08,25.91 20.32,26.67 19.05,26.67 17.78,27.94 17.78,39.37 18.29,39.88 18.29,45.72 17.77,46.24 | D4.C 17.77,46.24 | 17.77,46.24 17.76,46.23 16.38,46.23
  Top 0.813: 18.92,19.05 19.68,19.05 20.07,19.43 20.99,19.43
  Bottom 1.016: JP6.1 66.04,3.81 65.53,4.32 45.34,4.32 42.29,1.27 16.51,1.27 15.24,2.54 15.24,14.35 16.13,15.24 20.32,15.24 21.08,14.48 v21.08,14.36
VCCA
  Top 0.178: U1.63 69.98,26.67 70.48,26.16 C1.1
VCCD  (via drill 0.38)
  Top 0.178: U1.86 61.96,33.29 v62.23,33.02 | 61.46,19.68 U1.39 61.46,17.41 61.98,16.89 61.98,15.49 61.85,15.37 61.79,15.31 C7.1
  Top 0.406: 61.46,19.68 61.46,20.31 61.47,20.32 v61.47,29.08
  Bottom 0.406: v62.23,33.02 62.23,29.84 v61.47,29.08
VDDIO  (via drill 0.38)
  Top 0.178: U1.50 66.96,17.5 67.56,16.89 v68.2,16.89 68.71,16.89 69.85,18.03 69.85,19.04 69.83,19.05 C9.1 | C15.1 70.23,34.67 70.36,34.54 70.36,33.66 | U1.75 70.14,32.67 70.36,32.89 70.36,33.66 | 70.36,33.66 v69.34,33.66 | U7.17 31.14,28.17 31.37,27.94 C27.1 32.06,28.9 v32,28.96 31.99,28.94 | U7.35 31.14,37.62 31.24,37.72 C29.1 32.19,38.68 v32.13,38.73 32.12,38.72 | U7.52 23.22,36.22 22.93,36.5 C31.1 23.37,37.59 v24,36.96 | U7.67 23.36,30.22 22.86,29.72 21.59,29.72 | 21.59,29.72 21.59,29.84 v21.21,30.23 | 21.59,29.72 21.59,29.21 | 21.59,29.21 21.59,28.97 | v54.61,20.32 54.96,19.97 U1.26 54.96,17.75 54.86,17.65 54.36,17.65 54.23,17.78 54.23,18.8 54.16,18.87 C13.1 | C25.1 21.64,29.16 21.59,29.21 | R8.2 R7.2 45.3,30.57 v45.21,30.48
  pour Route2 (isolate 0.305): 0,53.34 110.49,53.34 110.49,0 0,0
VDDIO_ARDUINO  (via drill 0.25, 0.38, 0.51)
  Top 0.178: v55.24,33.02 54.96,33.3 U1.100 54.96,35.84 54.74,36.07 C11.1 | v80.64,31.75 85.09,31.75 JP13.2
  Top 1.016: S3.2 20.32,2.03 21.08,1.27 42.29,1.27 45.97,4.95 48.13,4.95 | 48.13,4.95 50.04,4.95 50.8,4.19 JP6.7 | 48.13,4.95 v48.13,6.86 | v48.13,10.03 v48.13,16.38
  Bottom 0.178: v55.24,33.02 59.44,33.02 60.58,34.16 62.99,34.16 64.14,33.02 64.14,32.26 64.64,31.75 v80.64,31.75
  Bottom 1.016: v48.13,6.86 v48.13,10.03 | v48.13,16.38 48.13,32.51 48.64,33.02 v55.24,33.02

## Text on the board
Top: 1
Route2: 2
Route15: 3
Bottom: 4 | v14
tPlace: GND | A5/SCL / P6.0 | A4/SDA / P6.1 | NC | GND | D13 / P6.7/SCK | D12/MISO / P6.6 | D11/MOSI / P6.5/PWM | D10/CS / P6.4/PWM | D9/PWM / P12.5 | D8 / P12.4 | D7 / P2.7 | D6/PWM / P2.6 | D5/PWM / P2.5 | D4 / P2.4 | D3/INT1 / P2.3/PWM | D2/INT0 / P2.2 | D1/TX / P2.1 | D0/RX / P2.0 | VDDIO | GND | 12.6 | 3.6 | 3.4 | 0.0 | VDDIO | 3.0 | 12.7 | 3.7 | 3.5 | 0.1 | 1.2 | 4.7 | 4.5 | 4.3 | 4.1 | 0.7 | 0.6 | GND | VDDIO | 2.5V- / 9V | - | + | D BYPASS | DEBUGGER IO | 4.6 | 4.4 | 4.2 | 4.0 | 0.5 | 0.4 | I2C / ISO | USER LED / D13/P6.7 | 0.3 | 0.2 | DEBUGGER LED / P3.1 | USB DEBUGGER | 0.1 | 0.0 | SAR0 / BP | DelSig / BP | CY8C5888AXI-LP096 | GND | DEBUGGER BTN / P2.2 | SAR1 / BP | VDDIO | 3.7 | 3.6 | CY8C5868LTI-LP039 | 3.5 | 3.4 | USB TARGET | 3.3 | 3.2 | DEBUGGER / RESET | DEBUGGER / SWD PORT | USER BTN / P1.2 | 3.1 | 3.0 | TARGET / SWD PORT | TARGET / RESET | 2.5V- / 9V | BATT / ISOLATE | 5.1 | 5.0 | V SEL | FreeSoC2 | 5.3 | 5.2 | VDDIO / 0 1 3 | PSoC5LP / Dev Board | 5.5 | 5.4 | 5.7 | 5.6 | ARDUINO / VDDIO2 | VDDIO | NC | VDDIO / ARDUINO | !RESET | 3.3V | 5V | GND | GND | V_IN | A0 / P15.5 | A1 / P15.4 | A2 / P6.3 | A3 / P6.2 | A4/SDA / P6.1 | A5/SCL / P6.0 | GND | VDDIO | SIO P12.0 | SIO P12.1 | SIO P12.2 | SIO P12.3 | SIO P12.6 | SIO P12.7 | GND | 5V | 3.3V
Measures: Measurement units given in inches
tDocu: LAYER / NUMBERS | Mike Hord